# Altium schematic sheet 08 EC&SD.SchDoc
size 420 x 297 mm
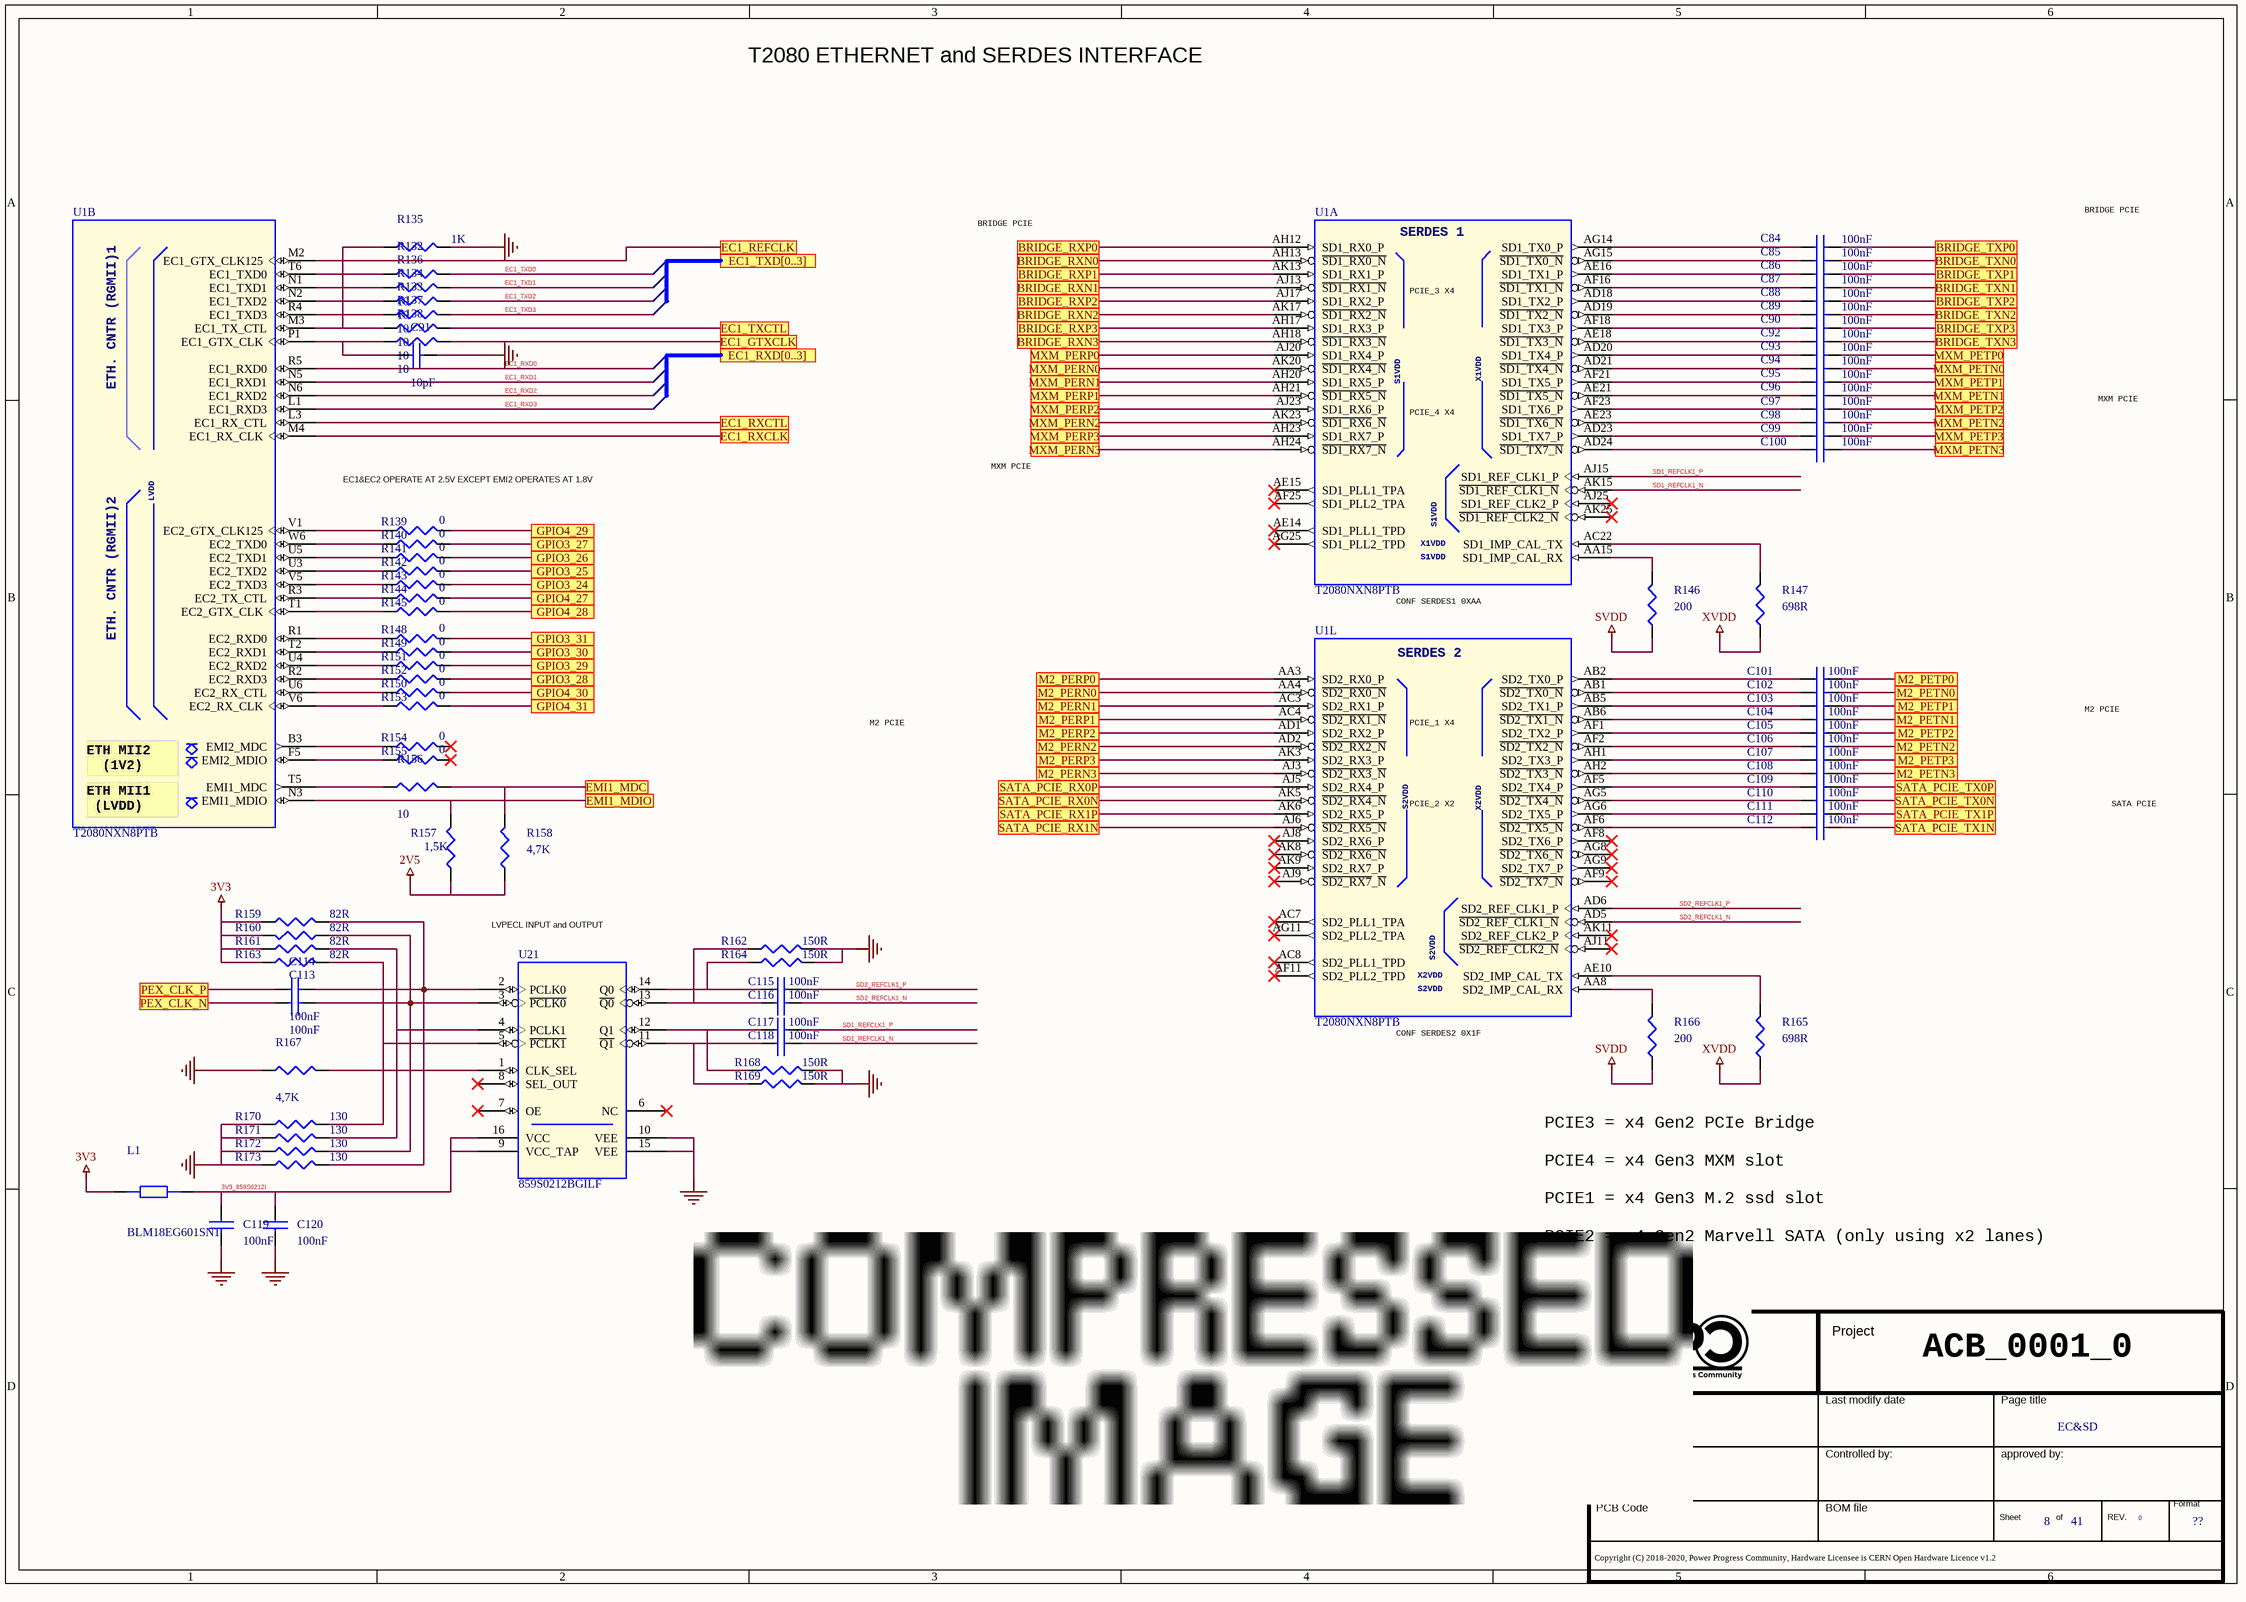
[diagram p0: 08 EC&SD.SchDoc]

## Parts
*  Doc: EC&SD  Page Count: 41  Page Number: 8  Page Size: ??  RevCode: 0  (hidden comment: Title_block_PPC)  (graphical)
C84  100nF  [SMD_0201]
C85  100nF  [SMD_0201]
C86  100nF  [SMD_0201]
C87  100nF  [SMD_0201]
C88  100nF  [SMD_0201]
C89  100nF  [SMD_0201]
C90  100nF  [SMD_0201]
C91  10pF  [SMD_0402]
C92  100nF  [SMD_0201]
C93  100nF  [SMD_0201]
C94  100nF  [SMD_0201]
C95  100nF  [SMD_0201]
C96  100nF  [SMD_0201]
C97  100nF  [SMD_0201]
C98  100nF  [SMD_0201]
C99  100nF  [SMD_0201]
C100  100nF  [SMD_0201]
C101  100nF  [SMD_0201]
C102  100nF  [SMD_0201]
C103  100nF  [SMD_0201]
C104  100nF  [SMD_0201]
C105  100nF  [SMD_0201]
C106  100nF  [SMD_0201]
C107  100nF  [SMD_0201]
C108  100nF  [SMD_0201]
C109  100nF  [SMD_0201]
C110  100nF  [SMD_0201]
C111  100nF  [SMD_0201]
C112  100nF  [SMD_0201]
C113  100nF  [SMD_0402]
C114  100nF  [SMD_0402]
C115  100nF  [SMD_0402]
C116  100nF  [SMD_0402]
C117  100nF  [SMD_0402]
C118  100nF  [SMD_0402]
C119  100nF  [SMD_0402]
C120  100nF  [SMD_0402]
L1  BLM18EG601SN1  [SMD_0603]
R132  10  [SMD_0402]
R133  10  [SMD_0402]
R134  10  [SMD_0402]
R135  1K  [SMD_0402]
R136  10  [SMD_0402]
R137  10  [SMD_0402]
R138  10  [SMD_0402]
R139  0  [SMD_0402]
R140  0  [SMD_0402]
R141  0  [SMD_0402]
R142  0  [SMD_0402]
R143  0  [SMD_0402]
R144  0  [SMD_0402]
R145  0  [SMD_0402]
R146  200  [SMD_0402]
R147  698R  [SMD_0402]
R148  0  [SMD_0402]
R149  0  [SMD_0402]
R150  0  [SMD_0402]
R151  0  [SMD_0402]
R152  0  [SMD_0402]
R153  0  [SMD_0402]
R154  0  [SMD_0402]
R155  0  [SMD_0402]
R156  10  [SMD_0402]
R157  1,5K  [SMD_0402]
R158  4,7K  [SMD_0402]
R159  82R  [SMD_0402]
R160  82R  [SMD_0402]
R161  82R  [SMD_0402]
R162  150R  [SMD_0402]
R163  82R  [SMD_0402]
R164  150R  [SMD_0402]
R165  698R  [SMD_0402]
R166  200  [SMD_0402]
R167  4,7K  [SMD_0402]
R168  150R  [SMD_0402]
R169  150R  [SMD_0402]
R170  130  [SMD_0402]
R171  130  [SMD_0402]
R172  130  [SMD_0402]
R173  130  [SMD_0402]
U1  T2080NXN8PTB  [bga]  (parts A,B,L of 14)
U21  859S0212BGILF  [tssop_16]

## Ports
BRIDGE_RXN0, BRIDGE_RXN1, BRIDGE_RXN2, BRIDGE_RXN3, BRIDGE_RXP0, BRIDGE_RXP1, BRIDGE_RXP2, BRIDGE_RXP3, BRIDGE_TXN0, BRIDGE_TXN1, BRIDGE_TXN2, BRIDGE_TXN3, BRIDGE_TXP0, BRIDGE_TXP1, BRIDGE_TXP2, BRIDGE_TXP3, EC1_GTXCLK, EC1_REFCLK, EC1_RXCLK, EC1_RXCTL, EC1_RXD[0..3], EC1_TXCTL, EC1_TXD[0..3], EMI1_MDC, EMI1_MDIO, GPIO3_24, GPIO3_25, GPIO3_26, GPIO3_27, GPIO3_28, GPIO3_29, GPIO3_30, GPIO3_31, GPIO4_27, GPIO4_28, GPIO4_29, GPIO4_30, GPIO4_31, M2_PERN0, M2_PERN1, M2_PERN2, M2_PERN3, M2_PERP0, M2_PERP1, M2_PERP2, M2_PERP3, M2_PETN0, M2_PETN1, M2_PETN2, M2_PETN3, M2_PETP0, M2_PETP1, M2_PETP2, M2_PETP3, MXM_PERN0, MXM_PERN1, MXM_PERN2, MXM_PERN3, MXM_PERP0, MXM_PERP1, MXM_PERP2, MXM_PERP3, MXM_PETN0, MXM_PETN1, MXM_PETN2, MXM_PETN3, MXM_PETP0, MXM_PETP1, MXM_PETP2, MXM_PETP3, PEX_CLK_N, PEX_CLK_P, SATA_PCIE_RX0N, SATA_PCIE_RX0P, SATA_PCIE_RX1N, SATA_PCIE_RX1P, SATA_PCIE_TX0N, SATA_PCIE_TX0P, SATA_PCIE_TX1N, SATA_PCIE_TX1P

## Nets
2V5: R157.1 R158.1
3V3: L1.1 R159.1 R160.2 R161.1 R163.1
GND: C91.2 C119.2 C120.2 R135.2 R162.2 R164.2 R167.1 R168.2 R169.2 R170.1 R171.1 R172.1 R173.1 U21.10(VEE) U21.15(VEE)
SVDD: R146.1 R166.1
XVDD: R147.1 R165.1
3V3_859S0212I: C119.1 C120.1 L1.2 U21.9(VCC_TAP) U21.16(VCC)
BRIDGE_RXN0: U1.AH13(~{SD1_RX0_N}) ; port BRIDGE_RXN0
BRIDGE_RXN1: U1.AJ13(~{SD1_RX1_N}) ; port BRIDGE_RXN1
BRIDGE_RXN2: U1.AK17(~{SD1_RX2_N}) ; port BRIDGE_RXN2
BRIDGE_RXN3: U1.AH18(~{SD1_RX3_N}) ; port BRIDGE_RXN3
BRIDGE_RXP0: U1.AH12(SD1_RX0_P) ; port BRIDGE_RXP0
BRIDGE_RXP1: U1.AK13(SD1_RX1_P) ; port BRIDGE_RXP1
BRIDGE_RXP2: U1.AJ17(SD1_RX2_P) ; port BRIDGE_RXP2
BRIDGE_RXP3: U1.AH17(SD1_RX3_P) ; port BRIDGE_RXP3
BRIDGE_TXN0: C85.2 ; port BRIDGE_TXN0
BRIDGE_TXN1: C87.2 ; port BRIDGE_TXN1
BRIDGE_TXN2: C89.2 ; port BRIDGE_TXN2
BRIDGE_TXN3: C92.2 ; port BRIDGE_TXN3
BRIDGE_TXP0: C84.2 ; port BRIDGE_TXP0
BRIDGE_TXP1: C86.2 ; port BRIDGE_TXP1
BRIDGE_TXP2: C88.2 ; port BRIDGE_TXP2
BRIDGE_TXP3: C90.2 ; port BRIDGE_TXP3
EC1_GTXCLK: R138.2 ; port EC1_GTXCLK
EC1_REFCLK: U1.M2(EC1_GTX_CLK125) ; port EC1_REFCLK
EC1_RXCLK: U1.M4(EC1_RX_CLK) ; port EC1_RXCLK
EC1_RXCTL: U1.L3(EC1_RX_CTL) ; port EC1_RXCTL
EC1_RXD0: U1.R5(EC1_RXD0)
EC1_RXD1: U1.N5(EC1_RXD1)
EC1_RXD2: U1.N6(EC1_RXD2)
EC1_RXD3: U1.L1(EC1_RXD3)
EC1_TXCTL: R137.2 ; port EC1_TXCTL
EC1_TXD0: R132.2
EC1_TXD1: R136.2
EC1_TXD2: R134.2
EC1_TXD3: R133.2
EMI1_MDC: R156.2 R158.2 ; port EMI1_MDC
EMI1_MDIO: R157.2 U1.N3(EMI1_MDIO) ; port EMI1_MDIO
GPIO3_24: R143.2 ; port GPIO3_24
GPIO3_25: R142.2 ; port GPIO3_25
GPIO3_26: R141.2 ; port GPIO3_26
GPIO3_27: R140.2 ; port GPIO3_27
GPIO3_28: R152.2 ; port GPIO3_28
GPIO3_29: R151.2 ; port GPIO3_29
GPIO3_30: R149.2 ; port GPIO3_30
GPIO3_31: R148.2 ; port GPIO3_31
GPIO4_27: R144.2 ; port GPIO4_27
GPIO4_28: R145.2 ; port GPIO4_28
GPIO4_29: R139.2 ; port GPIO4_29
GPIO4_30: R150.2 ; port GPIO4_30
GPIO4_31: R153.2 ; port GPIO4_31
M2_PERN0: U1.AA4(~{SD2_RX0_N}) ; port M2_PERN0
M2_PERN1: U1.AC3(SD2_RX1_P) ; port M2_PERN1
M2_PERN2: U1.AD2(~{SD2_RX2_N}) ; port M2_PERN2
M2_PERN3: U1.AJ3(~{SD2_RX3}_~{N}) ; port M2_PERN3
M2_PERP0: U1.AA3(SD2_RX0_P) ; port M2_PERP0
M2_PERP1: U1.AC4(~{SD2_RX1_N}) ; port M2_PERP1
M2_PERP2: U1.AD1(SD2_RX2_P) ; port M2_PERP2
M2_PERP3: U1.AK3(SD2_RX3_P) ; port M2_PERP3
M2_PETN0: C102.2 ; port M2_PETN0
M2_PETN1: C104.2 ; port M2_PETN1
M2_PETN2: C106.2 ; port M2_PETN2
M2_PETN3: C108.2 ; port M2_PETN3
M2_PETP0: C101.2 ; port M2_PETP0
M2_PETP1: C103.2 ; port M2_PETP1
M2_PETP2: C105.2 ; port M2_PETP2
M2_PETP3: C107.2 ; port M2_PETP3
MXM_PERN0: U1.AK20(~{SD1_RX4_N}) ; port MXM_PERN0
MXM_PERN1: U1.AH20(SD1_RX5_P) ; port MXM_PERN1
MXM_PERN2: U1.AK23(~{SD1_RX6}_~{N}) ; port MXM_PERN2
MXM_PERN3: U1.AH24(~{SD1_RX7_N}) ; port MXM_PERN3
MXM_PERP0: U1.AJ20(SD1_RX4_P) ; port MXM_PERP0
MXM_PERP1: U1.AH21(~{SD1_RX5_N}) ; port MXM_PERP1
MXM_PERP2: U1.AJ23(SD1_RX6_P) ; port MXM_PERP2
MXM_PERP3: U1.AH23(SD1_RX7_P) ; port MXM_PERP3
MXM_PETN0: C94.2 ; port MXM_PETN0
MXM_PETN1: C96.2 ; port MXM_PETN1
MXM_PETN2: C98.2 ; port MXM_PETN2
MXM_PETN3: C100.2 ; port MXM_PETN3
MXM_PETP0: C93.2 ; port MXM_PETP0
MXM_PETP1: C95.2 ; port MXM_PETP1
MXM_PETP2: C97.2 ; port MXM_PETP2
MXM_PETP3: C99.2 ; port MXM_PETP3
PEX_CLK_N: C113.1 ; port PEX_CLK_N
PEX_CLK_P: C114.1 ; port PEX_CLK_P
SATA_PCIE_RX0N: U1.AK5(~{SD2_RX4_N}) ; port SATA_PCIE_RX0N
SATA_PCIE_RX0P: U1.AJ5(SD2_RX4_P) ; port SATA_PCIE_RX0P
SATA_PCIE_RX1N: U1.AJ6(~{SD2_RX5_N}) ; port SATA_PCIE_RX1N
SATA_PCIE_RX1P: U1.AK6(SD2_RX5_P) ; port SATA_PCIE_RX1P
SATA_PCIE_TX0N: C110.2 ; port SATA_PCIE_TX0N
SATA_PCIE_TX0P: C109.2 ; port SATA_PCIE_TX0P
SATA_PCIE_TX1N: C112.2 ; port SATA_PCIE_TX1N
SATA_PCIE_TX1P: C111.2 ; port SATA_PCIE_TX1P
SD1_REFCLK1_N: C118.2 U1.AK15(~{SD1_REF_CLK1_N})
SD1_REFCLK1_P: C117.2 U1.AJ15(SD1_REF_CLK1_P)
SD2_REFCLK1_N: C116.2 U1.AD5(~{SD2_REF_CLK1_N})
SD2_REFCLK1_P: C115.2 U1.AD6(SD2_REF_CLK1_P)
NetC84_1: C84.1 U1.AG14(SD1_TX0_P)
NetC85_1: C85.1 U1.AG15(~{SD1_TX0_N})
NetC86_1: C86.1 U1.AE16(SD1_TX1_P)
NetC87_1: C87.1 U1.AF16(~{SD1_TX1_N})
NetC88_1: C88.1 U1.AD18(SD1_TX2_P)
NetC89_1: C89.1 U1.AD19(~{SD1_TX2_N})
NetC90_1: C90.1 U1.AF18(SD1_TX3_P)
NetC91_1: C91.1 R138.1 U1.P1(EC1_GTX_CLK)
NetC92_1: C92.1 U1.AE18(~{SD1_TX3_N})
NetC93_1: C93.1 U1.AD20(SD1_TX4_P)
NetC94_1: C94.1 U1.AD21(~{SD1_TX4_N})
NetC95_1: C95.1 U1.AF21(SD1_TX5_P)
NetC96_1: C96.1 U1.AE21(~{SD1_TX5_N})
NetC97_1: C97.1 U1.AF23(SD1_TX6_P)
NetC98_1: C98.1 U1.AE23(~{SD1_TX6_N})
NetC99_1: C99.1 U1.AD23(SD1_TX7_P)
NetC100_1: C100.1 U1.AD24(~{SD1_TX7_N})
NetC101_1: C101.1 U1.AB2(SD2_TX0_P)
NetC102_1: C102.1 U1.AB1(~{SD2_TX0_N})
NetC103_1: C103.1 U1.AB5(SD2_TX1_P)
NetC104_1: C104.1 U1.AB6(~{SD2_TX1_N})
NetC105_1: C105.1 U1.AF1(SD2_TX2_P)
NetC106_1: C106.1 U1.AF2(~{SD2_TX2_N})
NetC107_1: C107.1 U1.AH1(SD2_TX3_P)
NetC108_1: C108.1 U1.AH2(~{SD2_TX3_N})
NetC109_1: C109.1 U1.AF5(SD2_TX4_P)
NetC110_1: C110.1 U1.AG5(~{SD2_TX4_N})
NetC111_1: C111.1 U1.AG6(SD2_TX5_P)
NetC112_1: C112.1 U1.AF6(~{SD2_TX5_N})
NetC113_2: C113.2 R160.1 R172.2 U21.3(~{PCLK0})
NetC114_2: C114.2 R159.2 R173.2 U21.2(PCLK0)
NetC115_1: C115.1 R164.1 U21.14(Q0)
NetC116_1: C116.1 R162.1 U21.13(~{Q0})
NetC117_1: C117.1 R168.1 U21.12(Q1)
NetC118_1: C118.1 R169.1 U21.11(~{Q1})
NetR132_1: R132.1 U1.T6(EC1_TXD0)
NetR133_1: R133.1 U1.R4(EC1_TXD3)
NetR134_1: R134.1 U1.N2(EC1_TXD2)
NetR135_1: R135.1 R137.1 U1.M3(EC1_TX_CTL)
NetR136_1: R136.1 U1.N1(EC1_TXD1)
NetR139_1: R139.1 U1.V1(EC2_GTX_CLK125)
NetR140_1: R140.1 U1.W6(EC2_TXD0)
NetR141_1: R141.1 U1.U5(EC2_TXD1)
NetR142_1: R142.1 U1.U3(EC2_TXD2)
NetR143_1: R143.1 U1.V5(EC2_TXD3)
NetR144_1: R144.1 U1.R3(EC2_TX_CTL)
NetR145_1: R145.1 U1.T1(EC2_GTX_CLK)
NetR146_2: R146.2 U1.AA15(SD1_IMP_CAL_RX)
NetR147_2: R147.2 U1.AC22(SD1_IMP_CAL_TX)
NetR148_1: R148.1 U1.R1(EC2_RXD0)
NetR149_1: R149.1 U1.T2(EC2_RXD1)
NetR150_1: R150.1 U1.U6(EC2_RX_CTL)
NetR151_1: R151.1 U1.U4(EC2_RXD2)
NetR152_1: R152.1 U1.R2(EC2_RXD3)
NetR153_1: R153.1 U1.V6(EC2_RX_CLK)
NetR154_1: R154.1 U1.B3(EMI2_MDC)
NetR155_1: R155.1 U1.F5(EMI2_MDIO)
NetR156_1: R156.1 U1.T5(EMI1_MDC)
NetR161_2: R161.2 R171.2 U21.4(PCLK1)
NetR163_2: R163.2 R170.2 U21.5(~{PCLK1})
NetR165_2: R165.2 U1.AE10(SD2_IMP_CAL_TX)
NetR166_2: R166.2 U1.AA8(SD2_IMP_CAL_RX)
NetR167_2: R167.2 U21.1(CLK_SEL)

Not connected (* = marked no-connect by the designer): R154 2*; R155 2*; U1 AC7(SD2_PLL1_TPA)* AC8(SD2_PLL1_TPD)* AE14(SD1_PLL1_TPD)* AE15(SD1_PLL1_TPA)* AF8(SD2_TX6_P)* AF9(~{SD2_TX7_N})* AF11(SD2_PLL2_TPD)* AF25(SD1_PLL2_TPA)* AG8(~{SD2_TX6_N})* AG9(SD2_TX7_P)* AG11(SD2_PLL2_TPA)* AG25(SD1_PLL2_TPD)* AJ8(SD2_RX6_P)* AJ9(~{SD2_RX7}_~{N})* AJ11(~{SD2_REF_CLK2_N})* AJ25(SD1_REF_CLK2_P)* AK8(~{SD2_RX6_N})* AK9(SD2_RX7_P)* AK11(SD2_REF_CLK2_P)* AK25(~{SD1_REF_CLK2_N})*; U21 6(NC)* 7(OE)* 8(SEL_OUT)*

## Notes on the sheet
- T2080 ETHERNET and SERDES INTERFACE
- BRIDGE PCIE
- (near U1) PCIE_3 X4
- (near U1) PCIE_4 X4
- MXM PCIE
- EC1&EC2 OPERATE AT 2.5V EXCEPT EMI2 OPERATES AT 1.8V
- (near U1) CONF SERDES1 0XAA
- M2 PCIE
- (near U1) PCIE_1 X4
- (near U1) PCIE_2 X2
- SATA PCIE
- LVPECL INPUT and OUTPUT
- (near U1) CONF SERDES2 0X1F
- PCIE3 = x4 Gen2 PCIe Bridge
  PCIE4 = x4 Gen3 MXM slot
  PCIE1 = x4 Gen3 M.2 ssd slot
  PCIE2 = x4 Gen2 Marvell SATA (only using x2 lanes)
- ACB_0001_0
- (in symbol T2080, part A) SERDES 1; S1VDD; X1VDD
- (in symbol T2080, part B) ETH. CNTR (RGMII)1; LVDD; ETH. CNTR (RGMII)2; ETH MII2 / (1V2); ETH MII1 / (LVDD)
- (in symbol T2080, part L) SERDES 2; S2VDD; X2VDD
- (in symbol Title_block_PPC) Project; Creation Date; Last modify date; Page title; Designed by:; Controlled by:; approved by:; Format; PCB Code; BOM file; Sheet; of; REV.; Copyright (C) 2018-2020, Power Progress Community, Hardware Licensee is CERN Open Hardware Licence v1.2

## Library data of the parts
* = Title_block_PPC: Title: T2080PCIe; Schematic Page Count: 45; Schematic Page Number: 9; Author: MICETEK; Page Create Date: March  8, 1995; Page Title: ?; Page Modify Date: *
C84-C90 C92-C100 C102-C104 C106 C108-C112 = CAP NP_Dup2: CAP CER 0.1UF 6.3V 20% X5R 0201; Manufacturer Part Number 1: C0603X5R0J104M030BC; Manufacturer 1: TDK; Part Number: PASSIVE_3; RSM: RC0201; Part Type: Capacitors\Ceramic\SMD\0201; PCB Footprint: SMD_0201
C91 = CAP NP_Dup2: COND.CER.10PF 50V 0402 NPO/COG SMD; Manufacturer Part Number 1: GRM1555C1H100JZ01D; Manufacturer 1: Murata; Part Number: PASSIVE_32; RSM: RC0402; PCB Footprint: SMD_0402; Part Type: Capacitors\Ceramic\SMD\0402
C101 C105 C107 = CAP NP_Dup2: CAP CER 0.1UF 6.3V 20% X5R 0201; Part Number: PASSIVE_3; Manufacturer 1: TDK; Manufacturer Part Number 1: C0603X5R0J104M030BC; RSM: RC0201; Part Type: Capacitors\Ceramic\SMD\0201; PCB Footprint: SMD_0201
C113-C120 = CAP NP_Dup2: COND.CER. 100NF 50V 0402 X7R SMD; Part Number: PASSIVE_24; Manufacturer 1: TDK; Manufacturer Part Number 1: CGA2B3X7R1H104M050BD; RSM: RC0402; Part Type: Capacitors\Ceramic\SMD\0402; PCB Footprint: SMD_0402
L1 = FERRITE_BEAD: FERRITE BEAD 600ohm 500mA 0603 SMD; Part Number: PASSIVE_377; Manufacturer 1: Murata; Manufacturer Part Number 1: BLM18EG601SN1 SMD; RSM: RC0603; PCB Footprint: SMD_0603; Part Type: Ferrite Beads\SMD\0603
R132-R134 R136-R138 R156 = R_Dup5: RESIS.CHIP 10R 5% 0402 SMD; Part Number: PASSIVE_811; Manufacturer 1: ROYAL OHM; RSM: RC0402; PCB Footprint: SMD_0402; Part Type: Resistors\Fixed\SMD\0402\5%; Manufacturer Part Number 1: RESIS.CHIP 10R 5% 0402 SMD
R135 = R_Dup5: RESIS.CHIP 1K 1% 0402 SMD; Manufacturer 1: ROYAL OHM; Part Number: PASSIVE_628; RSM: RC0402; PCB Footprint: SMD_0402; Manufacturer Part Number 1: RESIS.CHIP 1K 1% 0402 SMD; Part Type: Resistors\Fixed\SMD\0402\1%
R139-R145 R154 R155 = R_Dup5: RESIS.CHIP 0R 5% 0402 SMD; Manufacturer 1: ROYAL OHM; Part Number: PASSIVE_805; RSM: RC0402; PCB Footprint: SMD_0402; Distributor 1: CAMEL ELETTRONICA SRL  #; Manufacturer Part Number 1: RESIS.CHIP 0R 5% 0402 SMD; Part Type: Resistors\Fixed\SMD\0402\5%
R146 R166 = R_Dup5: RES 200 OHM 1/10W 1% 0402 SMD; Part Number: PASSIVE_639; Manufacturer 1: PANASONIC; Manufacturer Part Number 1: ERJ-2RKF2000X; RSM: RC0402; PCB Footprint: SMD_0402; Part Type: Resistors\Fixed\SMD\0402\1%
R147 R165 = R_Dup5: RESIS.CHIP 698R 1% 0402 SMD; Part Number: PASSIVE_1458; Manufacturer 1: ROYAL OHM; RSM: RC0402; PCB Footprint: SMD_0402; Part Type: Resistors\Fixed\SMD\0402\1%; Manufacturer Part Number 1: RESIS.CHIP 698R 1% 0402 SMD
R148-R153 = R_Dup5: RESIS.CHIP 0R 5% 0402 SMD; Part Number: PASSIVE_805; Manufacturer 1: ROYAL OHM; RSM: RC0402; PCB Footprint: SMD_0402; Part Type: Resistors\Fixed\SMD\0402\5%; Manufacturer Part Number 1: RESIS.CHIP 0R 5% 0402 SMD; Distributor 1: CAMEL ELETTRONICA SRL  #
R157 = R_Dup5: RES 1,5K OHM 1/10W 1% 0402 SMD; Part Number: PASSIVE_575; RSM: RC0402; PCB Footprint: SMD_0402; Part Type: Resistors\Fixed\SMD\0402\1%
R158 R167 = R_Dup5: RESIS.CHIP 4,7K 5% 0402 SMD; Part Number: PASSIVE_861; Manufacturer 1: ROYAL OHM; RSM: RC0402; PCB Footprint: SMD_0402; Part Type: Resistors\Fixed\SMD\0402\5%; Manufacturer Part Number 1: RESIS.CHIP 4,7K 5% 0402 SMD
R159-R161 R163 = R_Dup5: RESIS.CHIP 82R 1% 0402 SMD; Part Number: PASSIVE_792; Manufacturer 1: Vishay/Dale; Manufacturer Part Number 1: CRCW040282R0FKED; RSM: RC0402; PCB Footprint: SMD_0402; Part Type: Resistors\Fixed\SMD\0402\1%
R162 R164 R168 R169 = R_Dup5: RESIS.CHIP 150R 1% 0402 SMD; Part Number: PASSIVE_611; Manufacturer 1: YAGEO; Manufacturer Part Number 1: RC0402FR-07150RL; RSM: RC0402; PCB Footprint: SMD_0402; Part Type: Resistors\Fixed\SMD\0402\1%
R170-R173 = R_Dup5: RESIS.CHIP 130R 1% 0402 SMD; Part Number: PASSIVE_1444; Manufacturer 1: bourns; Manufacturer Part Number 1: CR0402-FX-1300GLF; RSM: RC0402; PCB Footprint: SMD_0402; Part Type: Resistors\Fixed\SMD\0402\1%
U1 = T2080: QRIQ MPU 1.87GT/s DDR3/3L 4x10GE; Part Number: MICROPROCESSOR_65; Manufacturer 1: NXP; Vendor: Freescale; PCB Footprint: BGA896; RSM: PBGA896-0_8MM-25X25; TYPE: IC; MPN: T2080; Part Type: 32 BIT; Manufacturer Part Number 1: T2080NXN8PTB; Distributor 1: MOUSER(841-T2080NXN8PTB)
U21 = ICS859S0212I: 2:2 Differential-to-LVPECL/LVDS Clock Multiplexer; Part Number: LOGIC_351; Manufacturer 1: RENESAS; PCB Footprint: TSSOP-16; Part Type: CLOCK\GENERATOR; Manufacturer Part Number 1: 859S0212BGILF; Distributor 1: AVNET(859S0212BGILF); RSM: TSSOP-16